# EAGLE design PPGGlove (EAGLE 9.6.2)
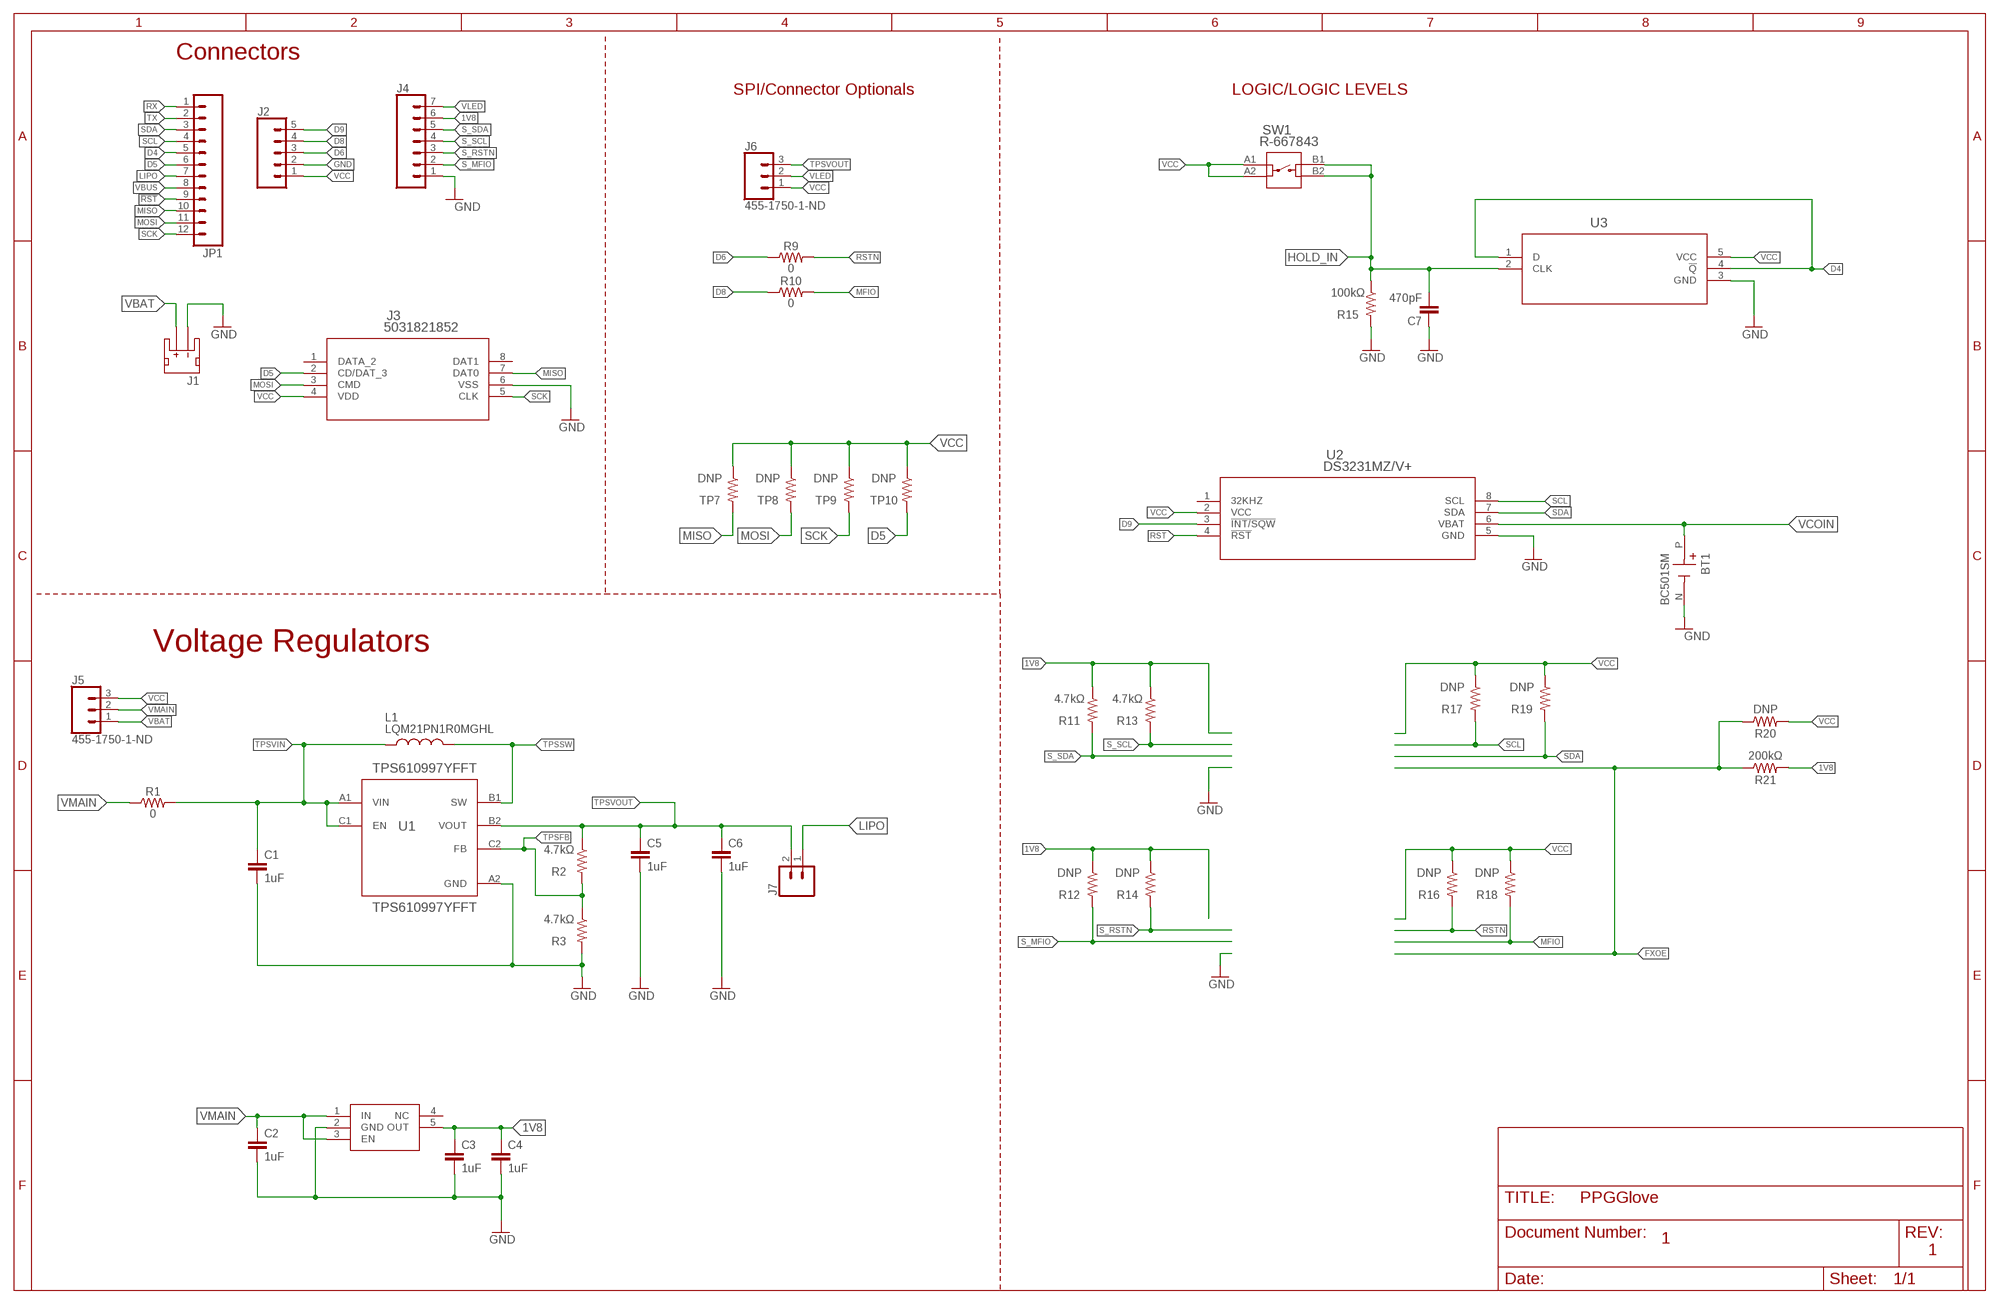
[diagram p0: schematic, sheet 1]

## Parts
BT1  BC501SM  [BAT_BC501SM]
C1  1uF  CAP-0805  [0805]
C2  1uF  CAP-0805  [0805]
C3  1uF  CAP-0805  [0805]
C4  1uF  CAP-0805  [0805]
C5  1uF  CAP-0805  [0805]
C6  1uF  CAP-0805  [0805]
C7  470pF  CAP-0805  [0805]
IC1  TPS7A0318DBVR  [SOT95P280X145-5N]
J1  JST_2MM_MALE  [JST-2-SMD]
J2  CONN_05  [1X05]
J3  5031821852  [503182-1852_MOL]
J4  CONN_07  [1X07]
J5  455-1750-1-ND  CONN_03  [1X03]
J6  455-1750-1-ND  CONN_03  [1X03]
J7  CONN_02  [1X02]
JP1  M12PTH  [1X12]
L1  LQM21PN1R0MGHL  [INDC2012X100N]
R1  0  RESISTOR0805  [0805]
R2  4.7kΩ  RESISTOR0805  [0805]
R3  4.7kΩ  RESISTOR0805  [0805]
R9  0  RESISTOR0805  [0805]
R10  0  RESISTOR0805  [0805]
R11  4.7kΩ  RESISTOR0805  [0805]
R12  DNP  RESISTOR0805  [0805]
R13  4.7kΩ  RESISTOR0805  [0805]
R14  DNP  RESISTOR0805  [0805]
R15  100kΩ  RESISTOR0805  [0805]
R16  DNP  RESISTOR0805  [0805]
R17  DNP  RESISTOR0805  [0805]
R18  DNP  RESISTOR0805  [0805]
R19  DNP  RESISTOR0805  [0805]
R20  DNP  RESISTOR0805  [0805]
R21  200kΩ  RESISTOR0805  [0805]
SW1  R-667843  [R-667843_MIT]
TP7  DNP  RESISTOR0805  [0805]
TP8  DNP  RESISTOR0805  [0805]
TP9  DNP  RESISTOR0805  [0805]
TP10  DNP  RESISTOR0805  [0805]
U1  TPS610997YFFT  [YFF0006AFAD]
U2  DS3231MZ/V+  [21-0041B_8_MXM]
U5  U3  SN74AUP1G80DBVR  [DBV5]

## Nets
1V8 [POWER]: C3.1 C4.1 IC1.5(OUT) J4.6 R11.1 R12.1 R13.1 R14.1 R21.2
!RST: JP1.9
D4: JP1.5 U5.1(D) U5.4(!Q)
D5: J3.2(CD/DAT_3) JP1.6 TP10.2
D6: J2.3 R9.1
D8: J2.4 R10.1
D9: J2.5 U2.3(!INT/SQW)
FXOE: R20.1 R21.1
GND [gnd]: BT1.N(-) C1.2 C2.2 C3.2 C4.2 C5.2 C6.2 C7.1 IC1.2(GND) J1.1(-) J2.2 J3.6(VSS) J4.1 R3.2 R15.2 U1.A2(GND) U2.5(GND) U5.3(GND)
HOLD_IN: C7.2 R15.1 SW1.B1 SW1.B2 U5.2(CLK)
LIPO [POWER]: J7.1 JP1.7
MFIO: R10.2 R18.2
MISO: J3.7(DAT0) JP1.10 TP7.2
MOSI: J3.3(CMD) JP1.11 TP8.2
RST: U2.4(!RST)
RSTN: R9.2 R16.2
RX: JP1.1
S_MFIO: J4.2 R12.2
S_RSTN: J4.3 R14.2
S_SCL: J4.4 R13.2
S_SDA: J4.5 R11.2
SCK: J3.5(CLK) JP1.12 TP9.2
SCL: JP1.4 R17.2 U2.8(SCL)
SDA: JP1.3 R19.2 U2.7(SDA)
TPSFB: R2.2 R3.1 U1.C2(FB)
TPSSW: L1.2 U1.B1(SW)
TPSVIN: C1.1 L1.1 R1.2 U1.A1(VIN) U1.C1(EN)
TPSVOUT [POWER]: C5.1 C6.1 J6.3 J7.2 R2.1 U1.B2(VOUT)
TX: JP1.2
VBAT [POWER]: J1.2(+) J5.1
VBUS [POWER]: JP1.8
VCC [POWER]: J2.1 J3.4(VDD) J5.3 J6.1 R16.1 R17.1 R18.1 R19.1 R20.2 SW1.A1 SW1.A2 TP7.1 TP8.1 TP9.1 TP10.1 U2.2(VCC) U5.5(VCC)
VCOIN [POWER]: BT1.P(+) U2.6(VBAT)
VLED [POWER]: J4.7 J6.2
VMAIN [POWER]: C2.1 IC1.1(IN) IC1.3(EN) J5.2 R1.1
Unconnected: IC1.4(NC) J1.NC1(PAD1) J1.NC2(PAD2) J3.1(DATA_2) J3.8(DAT1) U2.1(32KHZ)

## Notes on the sheet
- Connectors
- SPI/Connector Optionals | LOGIC/LOGIC LEVELS
- Voltage Regulators
- 1
- 1

## Library data of the parts
BT1 = BC501SM:BC501SM; DESCRIPTION: BATTERY HOLDER COIN 12MM SMD; DIGI-KEY_PART_NUMBER: BC501SM-ND; MF: MPD; MP: BC501SM; PACKAGE: None; PURCHASE-URL: https://pricing.snapeda.com/search/part/BC501SM/?ref=eda
C1-C7 = SparkFun-Capacitors:CAP
IC1 = SamacSys_Parts:TPS7A0318DBVR: LDO Voltage Regulators 200-mA, nanopower-IQ (200 nA), low-dropout (LDO) voltage regulator with enable 5-SOT-23 -40 to 125 Source: Datasheet <https://www.arrow.com/en/products/tps7a0318dbvr/texas-instruments>; ARROW_PART_NUMBER: TPS7A0318DBVR; ARROW_PRICE-STOCK: https://www.arrow.com/en/products/tps7a0318dbvr/texas-instruments; DESCRIPTION: LDO Voltage Regulators 200-mA, nanopower-IQ (200 nA), low-dropout (LDO) voltage regulator with enable 5-SOT-23 -40 to 125; HEIGHT: 1.45mm; MANUFACTURER_NAME: Texas Instruments; MANUFACTURER_PART_NUMBER: TPS7A0318DBVR; MOUSER_PART_NUMBER: 595-TPS7A0318DBVR; MOUSER_PRICE-STOCK: https://www.mouser.co.uk/ProductDetail/Texas-Instruments/TPS7A0318DBVR?qs=zW32dvEIR3svu15mOoFtOQ%3D%3D
J1 = SparkFun-Connectors:JST_2MM_MALE: JST 2MM MALE RA CONNECTOR Two pin, compact surface mount connector. Commonly used as a battery input connection point. We really like the solid locking feeling and high current rating on these small connectors. We use these all the time as battery connectors. Mates to single-cell LiPo batteries. Here is the connector we sell at SparkFun: JST Right Angle Connector - White <https://www.sparkfun.com/products/8612> (PRT-08612) Datasheet <http://www.sparkfun.com/datasheets/Prototyping/Connectors/JST-Horizontal.pdf> It was used on these SparkFun products: SparkFun MOSFET Power Controller <https://www.sparkfun.com/products/11214> (PRT-11214) SparkFun Battery Babysitter - LiPo Battery Manager <https://www.sparkfun.com/products/13777> (PRT-13777) And many, many others that required a lipo battery connection.; PROD_ID: CONN-11443; SF_ID: PRT-08612
J2 = SparkFun-Connectors:CONN_05: Multi connection point. Often used as Generic Header-pin footprint for 0.1 inch spaced/style header connections On any of the 0.1 inch spaced packages, you can populate with these: Break Away Headers - Straight <https://www.sparkfun.com/products/116> (PRT-00116) Break Away Male Headers - Right Angle <https://www.sparkfun.com/products/553> (PRT-00553) Female Headers <https://www.sparkfun.com/products/115> (PRT-00115) Break Away Headers - Machine Pin <https://www.sparkfun.com/products/117> (PRT-00117) Break Away Female Headers - Swiss Machine Pin <https://www.sparkfun.com/products/743> (PRT-00743) For SCREWTERMINALS and SPRING TERMINALS visit here: Screw Terimnals on SparkFun.com <https://www.sparkfun.com/search/results?term=Screw+Terminals> (5mm/3.5mm/2.54mm spacing) This device is also useful as a general connection point to wire up your design to another part of your project. Our various solder wires solder well into these plated through hole pads. Hook-Up Wire - Assortment (Stranded, 22 AWG) <https://www.sparkfun.com/products/11375> (PRT-11375) Hook-Up Wire - Assortment (Solid Core, 22 AWG) <https://www.sparkfun.com/products/11367> (PRT-11367) View the entire wire category on our website here <https://www.sparkfun.com/categories/141> Special notes: Molex polarized connector foot print use with SKU : PRT-08231 with associated crimp pins and housings. 1MM SMD Version SKU: PRT-10208
J3 = PPG-part2:5031821852; COPYRIGHT: Copyright (C) 2022 Ultra Librarian. All rights reserved.; MANUFACTURER_PART_NUMBER: 5031821852; MFR_NAME: Molex Connector Corporation
J4 = SparkFun-Connectors:CONN_07: Multi connection point. Often used as Generic Header-pin footprint for 0.1 inch spaced/style header connections On any of the 0.1 inch spaced packages, you can populate with these: Break Away Headers - Straight <https://www.sparkfun.com/products/116> (PRT-00116) Break Away Male Headers - Right Angle <https://www.sparkfun.com/products/553> (PRT-00553) Female Headers <https://www.sparkfun.com/products/115> (PRT-00115) Break Away Headers - Machine Pin <https://www.sparkfun.com/products/117> (PRT-00117) Break Away Female Headers - Swiss Machine Pin <https://www.sparkfun.com/products/743> (PRT-00743) For SCREWTERMINALS and SPRING TERMINALS visit here: Screw Terimnals on SparkFun.com <https://www.sparkfun.com/search/results?term=Screw+Terminals> (5mm/3.5mm/2.54mm spacing) This device is also useful as a general connection point to wire up your design to another part of your project. Our various solder wires solder well into these plated through hole pads. Hook-Up Wire - Assortment (Stranded, 22 AWG) <https://www.sparkfun.com/products/11375> (PRT-11375) Hook-Up Wire - Assortment (Solid Core, 22 AWG) <https://www.sparkfun.com/products/11367> (PRT-11367) View the entire wire category on our website here <https://www.sparkfun.com/categories/141> Special notes: Molex polarized connector foot print use with SKU : PRT-08231 with associated crimp pins and housings. 1MM SMD Version SKU: PRT-10208 NOTES ON THE VARIANTS LOCK and LOCK_LONGPADS... This footprint was designed to help hold the alignment of a through-hole component (i.e. 6-pin header) while soldering it into place. You may notice that each hole has been shifted either up or down by 0.005 of an inch from it's more standard position (which is a perfectly straight line). This slight alteration caused the pins (the squares in the middle) to touch the edges of the holes. Because they are alternating, it causes a "brace" to hold the component in place. 0.005 has proven to be the perfect amount of "off-center" position when using our standard breakaway headers. Although looks a little odd when you look at the bare footprint, once you have a header in there, the alteration is very hard to notice. Also,if you push a header all the way into place, it is covered up entirely on the bottom side.
J5 J6 = SparkFun-Connectors:CONN_03: Multi connection point. Often used as Generic Header-pin footprint for 0.1 inch spaced/style header connections On any of the 0.1 inch spaced packages, you can populate with these: Break Away Headers - Straight <https://www.sparkfun.com/products/116> (PRT-00116) Break Away Male Headers - Right Angle <https://www.sparkfun.com/products/553> (PRT-00553) Female Headers <https://www.sparkfun.com/products/115> (PRT-00115) Break Away Headers - Machine Pin <https://www.sparkfun.com/products/117> (PRT-00117) Break Away Female Headers - Swiss Machine Pin <https://www.sparkfun.com/products/743> (PRT-00743) Stackable Header - 3 Pin (Female, 0.1") <https://www.sparkfun.com/products/13875> (PRT-13875) For SCREWTERMINALS and SPRING TERMINALS visit here: Screw Terimnals on SparkFun.com <https://www.sparkfun.com/search/results?term=Screw+Terminals> (5mm/3.5mm/2.54mm spacing) This device is also useful as a general connection point to wire up your design to another part of your project. Our various solder wires solder well into these plated through hole pads. Hook-Up Wire - Assortment (Stranded, 22 AWG) <https://www.sparkfun.com/products/11375> (PRT-11375) Hook-Up Wire - Assortment (Solid Core, 22 AWG) <https://www.sparkfun.com/products/11367> (PRT-11367) View the entire wire category on our website here <https://www.sparkfun.com/categories/141> Special notes: Molex polarized connector foot print use with SKU : PRT-08232 with associated crimp pins and housings.; PROD_ID: XXX-00000
J7 = SparkFun-Connectors:CONN_02: Multi connection point. Often used as Generic Header-pin footprint for 0.1 inch spaced/style header connections On any of the 0.1 inch spaced packages, you can populate with these: Break Away Headers - Straight <https://www.sparkfun.com/products/116> (PRT-00116) Break Away Male Headers - Right Angle <https://www.sparkfun.com/products/553> (PRT-00553) Female Headers <https://www.sparkfun.com/products/115> (PRT-00115) Break Away Headers - Machine Pin <https://www.sparkfun.com/products/117> (PRT-00117) Break Away Female Headers - Swiss Machine Pin <https://www.sparkfun.com/products/743> (PRT-00743) For SCREWTERMINALS and SPRING TERMINALS visit here: Screw Terimnals on SparkFun.com <https://www.sparkfun.com/search/results?term=Screw+Terminals> (5mm/3.5mm/2.54mm spacing) This device is also useful as a general connection point to wire up your design to another part of your project. Our various solder wires solder well into these plated through hole pads. Hook-Up Wire - Assortment (Stranded, 22 AWG) <https://www.sparkfun.com/products/11375> (PRT-11375) Hook-Up Wire - Assortment (Solid Core, 22 AWG) <https://www.sparkfun.com/products/11367> (PRT-11367) View the entire wire category on our website here <https://www.sparkfun.com/categories/141> Special notes: Molex polarized connector foot print use with: PRT-08233 with associated crimp pins and housings. 2.54_SCREWTERM for use with PRT-10571. 3.5mm Screw Terminal footprints for PRT-08084 5mm Screw Terminal footprints for use with PRT-08432
JP1 = SparkFun-Connectors:M12: Header 12 Standard 12-pin 0.1" header. Use with straight break away headers (SKU : PRT-00116), right angle break away headers (PRT-00553), swiss pins (PRT-00743), machine pins (PRT-00117), and female headers (PRT-00115).; PROD_ID: CONN-09693
L1 = LQM21PN1R0MGHL:LQM21PN1R0MGHL: Ind Power Chip Shielded 1uH 20% 1MHz Ferrite 1.1A 0805 Embossed T/R; DESCRIPTION: Inductor with Inductance: 1uH Tol. +/-20%, Package: 0805 (2012); DIGI-KEY_PART_NUMBER: 490-9572-2-ND; MF: Murata; MP: LQM21PN1R0MGHL; PACKAGE: 2012 Murata; PURCHASE-URL: https://pricing.snapeda.com/search/part/LQM21PN1R0MGHL/?ref=eda
R1-R3 R9-R21 TP7-TP10 = SparkFun-Resistors:RESISTOR: Generic Resistor Package
SW1 = additionallppg:R-667843; COPYRIGHT: Copyright (C) 2022 Ultra Librarian. All rights reserved.; DIGI-KEY_PART_NUMBER_1: 2508-R-667843TR-ND; DIGI-KEY_PART_NUMBER_2: 2508-R-667843CT-ND; DIGI-KEY_PART_NUMBER_3: 2508-R-667843DKR-ND; MANUFACTURER_PART_NUMBER: R-667843; MFR_NAME: Mitsumi
U1 = additionallppg:TPS610997YFFT; COPYRIGHT: Copyright (C) 2022 Ultra Librarian. All rights reserved.; DIGI-KEY_PART_NUMBER_1: 2156-TPS610997YFFT-ND; DIGI-KEY_PART_NUMBER_2: 296-TPS610997YFFTCT-ND; DIGI-KEY_PART_NUMBER_3: 296-TPS610997YFFTDKR-ND; DIGI-KEY_PART_NUMBER_4: 296-TPS610997YFFTTR-ND; DIGI-KEY_PART_NUMBER_5: TPS610997YFFT-ND; MANUFACTURER_PART_NUMBER: TPS610997YFFT; MFR_NAME: Texas Instruments; REFDES: RefDes; TYPE: TYPE
U2 = additionallppg:DS3231MZ/V+; COPYRIGHT: Copyright (C) 2022 Ultra Librarian. All rights reserved.; DIGI-KEY_PART_NUMBER_1: DS3231MZ/V+-ND; MANUFACTURER_PART_NUMBER: DS3231MZ/V+; MFR_NAME: Maxim Integrated Products
U5 = PPG-part2:SN74AUP1G80DBVR; COPYRIGHT: Copyright (C) 2022 Ultra Librarian. All rights reserved.; DIGI-KEY_PART_NUMBER_1: 296-17841-1-ND; DIGI-KEY_PART_NUMBER_2: 296-17841-2-ND; DIGI-KEY_PART_NUMBER_3: 296-17841-6-ND; DIGI-KEY_PART_NUMBER_4: 2156-SN74AUP1G80DBVR-ND; MANUFACTURER_PART_NUMBER: SN74AUP1G80DBVR; MFR_NAME: Texas Instruments

## Net classes
1 usb: width 0.19 mm, drill 0.19 mm, clearance 0.127 mm

## Board
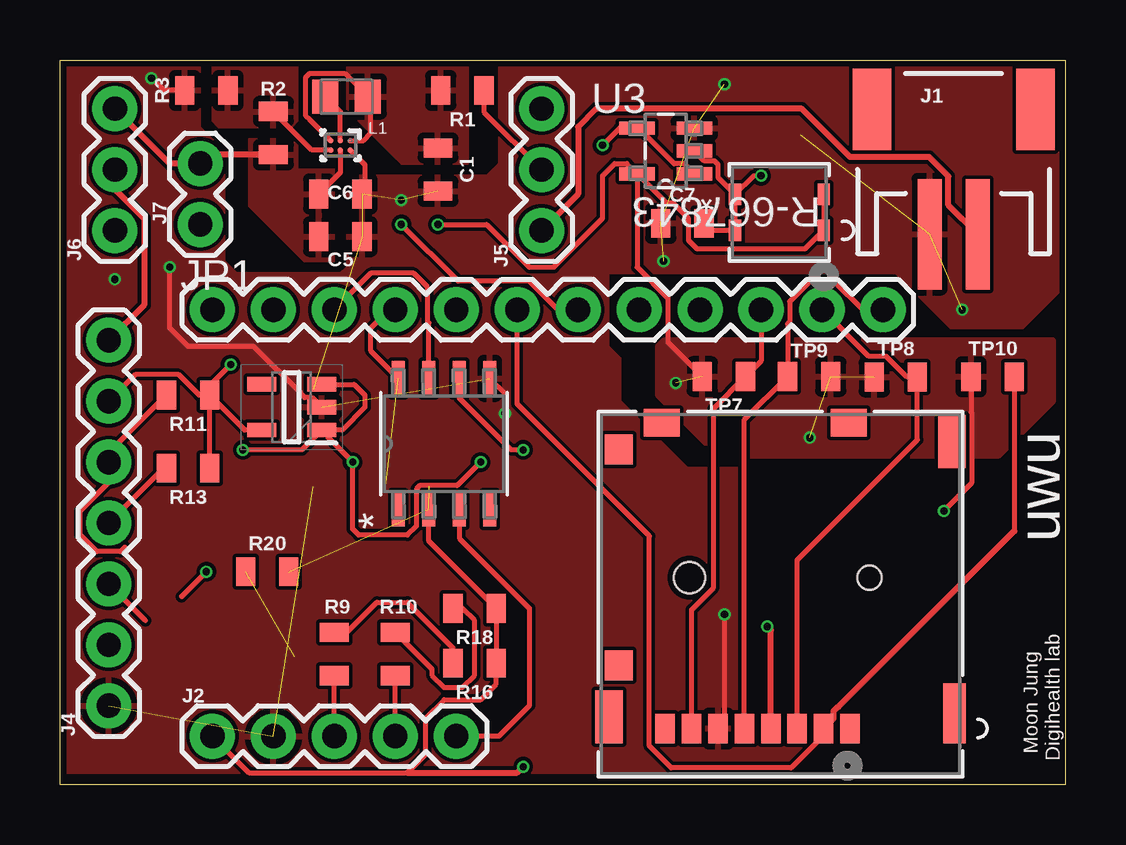
[diagram p1: board, top side]
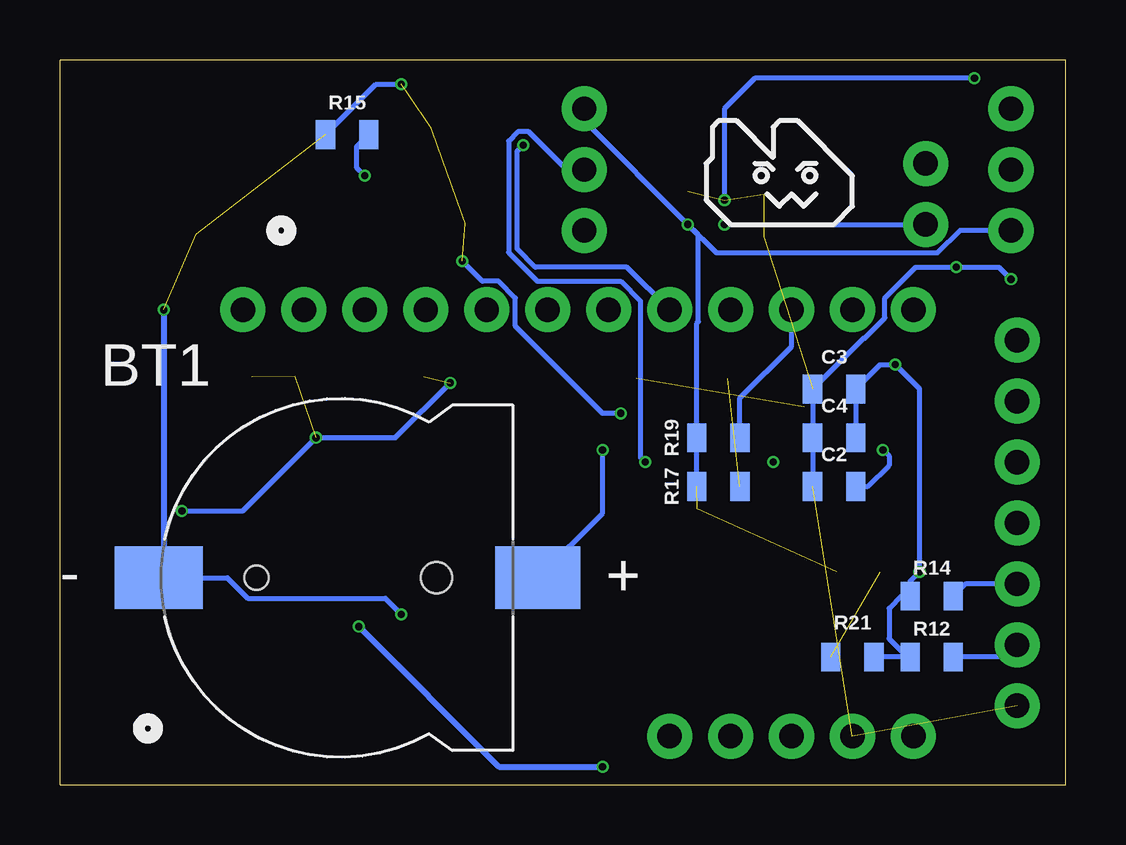
[diagram p2: board, bottom side, seen from below]

Size 41.91 x 30.23 mm. Coordinates in mm from the lower left corner, seen from the top.
Outline: 0,0 0,30.23 41.91,30.23 41.91,0 0,0
Copper layers (1*16): Top 0.035mm / dielectric 0.2mm / Bottom 0.035mm
Design rules "SeeedStudio_4layers *": minimum track width 8mil, minimum drill 0.19mm, track to track 6mil, track to pad 6mil, pad to pad 6mil, via to via 8mil, smd to smd 0mil, copper to edge 10mil, drill to drill 8mil, minimum pad ring 6mil, minimum via ring 4mil, stop-mask expansion 4mil, vias tented up to drill 20mil, thermal gap 10mil

### Footprints (pad centres in the part's own frame; a part is rotated, then mirrored left to right if it is on the bottom)
BAT_BC501SM = smd 3.66 x 2.6: N -7.57,0 | smd 3.54 x 2.6: P 8.23,0 | hole 1: -3.5,0 | hole 1.3: 4,0
0805 = smd 0.8 x 1.2: 1 -0.9,0; 2 0.9,0
SOT95P280X145-5N = smd 1.2 x 0.6: 1 -1.25,0.95; 2 -1.25,0; 3 -1.25,-0.95; 4 1.25,-0.95; 5 1.25,0.95
JST-2-SMD = smd 1 x 4.6: 1 -1,-3.7; 2 1,-3.7 | smd 1.6 x 3.4: NC1 -3.4,1.5; NC2 3.4,1.5
1X05 = drill 1.016 pad 1.88: 1 0,0; 2 2.54,0; 3 5.08,0; 4 7.62,0; 5 10.16,0
503182-1852_MOL = smd 0.813 x 1.245: 1 -2.9,-5.61; 2 -1.8,-5.61; 3 -0.7,-5.61; 4 0.4,-5.61; 5 1.5,-5.61; 6 2.6,-5.61; 7 3.7,-5.61; 8 4.8,-5.61 | smd 1.499 x 1.143: 9 -2.84,-18.365; 10 4.94,-18.365 | smd 0.94 x 2.489: 11 -7.245,-6.24 | smd 1.143 x 2.21: 12 7.145,-6.09; 13 -7.145,-17.57 | smd 1.168 x 1.245: 14 6.74,-8.24; 15 6.74,-17.24
1X07 = drill 1.016 pad 1.88: 1 0,0; 2 2.54,0; 3 5.08,0; 4 7.62,0; 5 10.16,0; 6 12.7,0; 7 15.24,0
1X03 = drill 1.016 pad 1.88: 1 0,0; 2 2.54,0; 3 5.08,0
1X02 = drill 1.016 pad 1.88: 1 0,0; 2 2.54,0
1X12 = drill 1.016 pad 1.88: 1 0,0; 2 2.54,0; 3 5.08,0; 4 7.62,0; 5 10.16,0; 6 12.7,0; 7 15.24,0; 8 17.78,0; 9 20.32,0; 10 22.86,0; 11 25.4,0; 12 27.94,0
INDC2012X100N = smd 1.1 x 1.42: 1 -0.885,0; 2 0.885,0
R-667843_MIT = smd 0.508 x 0.889: A1 -1.85,0.75; A2 -1.85,-0.75; B1 1.85,0.75; B2 1.85,-0.75
YFF0006AFAD = smd 0.23 x 0.23: A1 -0.2,0.4; A2 0.2,0.4; B1 -0.2,0; B2 0.2,0; C1 -0.2,-0.4; C2 0.2,-0.4
21-0041B_8_MXM = smd 1.46 x 0.533: 1 -2.724,1.905; 2 -2.724,0.635; 3 -2.724,-0.635; 4 -2.724,-1.905; 5 2.724,-1.905; 6 2.724,-0.635; 7 2.724,0.635; 8 2.724,1.905
DBV5 = smd 1.473 x 0.559: 1 -1.194,0.95; 2 -1.194,0; 3 -1.194,-0.95; 4 1.194,-0.95; 5 1.194,0.95

### Placement (x,y rotation side)
BT1  30.23,8.64 0 bottom
C1  15.75,25.65 270 top
C2  9.65,12.45 180 bottom
C3  9.65,16.51 180 bottom
C4  9.65,14.48 180 bottom
C5  11.68,22.86 0 top
C6  11.68,24.64 0 top
C7  25.93,23.42 0 top
IC1  9.65,15.75 180 top
J1  37.24,26.66 0 top
J2  6.35,2.03 0 top
J3  30.02,-3.26 180 top
J4  2.03,3.3 90 top
J5  20.07,23.11 90 top
J6  2.29,23.11 90 top
J7  5.84,23.37 90 top
JP1  6.35,19.81 0 top
L1  11.94,28.7 180 top
R1  16.76,28.96 180 top
R2  8.89,27.18 90 top
R3  6.1,28.96 180 top
R9  11.43,5.46 90 top
R10  13.97,5.46 90 top
R11  5.33,16.26 180 top
R12  5.59,5.33 0 bottom
R13  5.33,13.21 180 top
R14  5.59,7.87 0 bottom
R15  29.95,27.11 180 bottom
R16  17.27,5.08 180 top
R17  14.48,12.45 0 bottom
R18  17.27,7.37 180 top
R19  14.48,14.48 0 bottom
R20  8.64,8.89 0 top
R21  8.89,5.33 0 bottom
SW1  29.97,23.88 180 top
TP7  27.66,17.03 0 top
TP8  34.82,17.01 0 top
TP9  31.21,17.03 180 top
TP10  38.86,17.02 0 top
U1  11.68,26.67 270 top
U2  16,14.22 90 top
U5  25.24,26.43 180 top

### Tracks (layer width: path | path; a pad name or v marks a point on that pad's centre or on a via)
1V8  (via drill 0.3)
  Top 0.203: IC1.5 7.69,14.8 R11.1 | R11.1 5.79,16.26 4.94,17.11 3.14,17.11 J4.6 | R13.1 R11.1 | R11.1 6.23,16.65 v7.11,17.53 | 5.06,7.85 v6.1,8.89
  Bottom 0.203: C4.1 C3.1 7.74,17.53 v7.11,17.53 6.1,16.51 v6.1,8.89 6.49,8.5 R14.1 6.86,7.87 7.37,7.37 7.37,6.1 6.6,5.33 | R12.1 6.6,5.33 | 6.6,5.33 R21.2
D4  (via drill 0.3)
  Top 0.203: U5.1 26.02,25.9 25.59,25.9 24.11,27.38 U5.4 23.32,27.38 v22.61,26.67
  Bottom 0.203: JP1.5 18.29,21.59 22.1,21.59 22.86,22.35 22.86,26.42 v22.61,26.67
D5
  Top 0.203: TP10.2 39.76,10.58 | JP1.6 19.05,15.88 24.56,10.38 24.56,1.62 25.47,0.71 30.47,0.71 31.82,2.06 J3.2
  Top 0.254: J3.2 32.23,2.77 32.23,3.09 32.4,3.25 32.43,3.25 39.76,10.58
D6
  Top 0.203: J2.3 R9.1
D8
  Top 0.203: J2.4 R10.1
D9
  Top 0.203: U2.3 16.64,10.29 19.56,7.37 19.56,3.3 18.29,2.03 J2.5
FXOE  (1 unrouted)
GND  (via drill 0.3)  (12 unrouted)
  Top 0.203: U1.A2 12.7,25.85 12.7,24.75 C6.2 | IC1.2 10.51,16.14 10.2,16.14 10.05,16.29 10.05,16.31 8.07,18.29 5.33,18.29 4.57,19.05 v4.57,21.59 | U2.5 18.54,16.31 v18.54,15.49 | v27.69,7.11 27.69,2.62 J3.6 | R3.2 4.32,28.96 v3.81,29.46
  Bottom 0.203: BT1.N 34.94,8.64 34.08,7.78 28.35,7.78 v27.69,7.11 | R15.2 28.75,29.21 v27.69,29.21 | v18.54,15.49 19.3,15.49 22.94,19.13 22.94,20.31 23.64,21.01 24.31,21.01 v25.15,21.84 | C2.2 C4.2 C3.2 8.44,18.62 8.4,18.62 7.54,19.47 7.54,20.31 6.26,21.59 v4.57,21.59 2.79,21.59 v2.29,21.08 | v3.81,29.46 12.95,29.46 14.22,28.19 v14.22,24.38
  Bottom 0.254: v37.59,19.81 37.59,8.84 BT1.N
  pour Top: 5.84,27.43 5.84,29.97 0.25,29.97 0.25,0.51 41.15,0.51 41.15,13.21 26.16,13.21 23.37,16 23.37,17.78 22.86,18.29 22.86,21.34 34.8,21.34 37.08,19.05 40.13,19.05 41.66,20.57 41.66,29.97 18.29,29.97 18.29,25.91 17.78,25.4 11.94,25.4 11.94,21.59 11.68,21.34 7.37,21.34 6.86,21.84 6.86,26.42
HOLD_IN  (via drill 0.3)
  Top 0.203: SW1.B2 SW1.B1 27.12,23.13 C7.2 | SW1.B2 27.42,25.32 27.42,25.87 27.28,26.02 26.85,26.02 U5.2 | SW1.B2 28.9,25.4 v29.21,25.4
  Bottom 0.203: R15.1 29.56,26.61 29.56,25.75 v29.21,25.4
LIPO  (via drill 0.3)
  Top 0.203: v14.22,23.37 16.59,21.01 19.54,21.01 20.74,19.81 JP1.7
  Bottom 0.203: v14.22,23.37 J7.1
MFIO
  Top 0.203: R10.2 15.49,4.84 15.49,4.57 16,4.06 16.76,4.06 17.27,4.57 17.27,6.86 16.76,7.37 R18.2
MISO
  Top 0.203: JP1.10 29.21,17.68 28.75,17.22 TP7.2 27.23,15.7 27.23,8.22 26.32,7.31 J3.7
MOSI
  Top 0.203: J3.3 30.72,9.38 35.73,14.39 TP8.2 35.28,17.01 34.43,17.86 33.7,17.86 JP1.11
RSTN
  Top 0.203: R9.2 11.95,6.36 13.21,7.62 14.48,7.62 16.37,5.73 R16.2
S_MFIO
  Top 0.203: 2.55,6.36 J4.2
  Bottom 0.203: J4.2 2.54,5.33 R12.2
S_RSTN
  Top 0.203: 3.56,6.86 J4.3
  Bottom 0.203: J4.3 4.18,8.38 R14.2
S_SCL
  Top 0.203: 2.54,10.41 J4.4 4.32,13.21 R13.2
S_SDA
  Top 0.203: 2.71,9.91 2.53,9.73 1.54,9.73 0.84,10.43 0.84,11.42 2.03,12.61 J4.5 2.03,13.85 R11.2
SCK
  Top 0.203: J3.5 28.52,15.23 TP9.2 30.32,19.23 30.4,19.32 30.4,20.15 31.26,21.01 32.24,21.01 33.44,19.81 JP1.12
SCL  (1 unrouted)
  Top 0.203: U2.8 12.95,18.09 12.95,19.05 13.72,19.81 JP1.4
SDA
  Top 0.203: U2.7 15.37,19.27 15.32,19.32 15.32,20.75 14.73,21.34 12.95,21.34 JP1.3
  Bottom 0.203: R19.2 13.58,16.14 11.43,18.29 JP1.3
TPSFB
  Top 0.203: U1.C2 10.5,26.47 R2.2
  pour Top: 6.35,29.97 6.35,27.69 6.6,27.43 9.65,27.43 9.91,27.69 9.91,29.97
TPSSW
  Top 0.203: U1.B1 11.68,28.07 L1.2
TPSVIN
  Top 0.203: U1.A1 12.65,26.87 12.95,27.18 12.95,28.57 L1.1 11.86,29.67 10.4,29.67 10.25,29.52 10.25,27.89 10.4,27.74 10.42,27.74 U1.C1
  pour Top: 11.94,29.97 11.94,28.19 12.7,27.43 14.22,25.91 17.02,25.91 17.02,29.97
TPSVOUT
  Top 0.203: U1.B2 11.68,25.54 C6.1
  Top 0.254: R2.1 6.21,26.28 J7.2 4.57,25.91 J6.3
  pour Top: 7.87,26.92 7.87,24.13 10.16,21.84 11.43,21.84 11.43,25.65 9.91,25.65 9.91,26.92
VBAT
  Top 0.254: J1.2 37.02,24.18 37.02,25.38 36.21,26.18 32.92,26.18 30.91,28.19 22.35,28.19 21.59,27.43 21.59,24.64 J5.1
VCC  (via drill 0.3)  (5 unrouted)
  Top 0.203: U5.5 24.05,21.58 25.32,20.31 25.32,18.46 TP7.1 | U5.5 25.26,24.27 25.54,24.27 26.18,23.63 26.18,22.71 26.54,22.35 31.05,22.35 SW1.A1 SW1.A2 | v15.75,23.37 17.78,23.37 19.56,21.59 20.57,21.59 22.61,23.62 22.61,25.4 23.11,25.91 23.62,25.91 U5.5 | J2.1 7.87,0.51 14.48,0.51 15.24,1.27 15.24,2.79 16,3.56 17.53,3.56 18.17,4.2 R16.1 R18.1 15.44,10.1 15.37,10.17 U2.2 | TP10.1 37.96,15.55 37.99,15.52 37.99,12.59 v36.83,11.43
  Top 0.254: J3.4 29.62,6.45 v29.46,6.6 | 14.48,0.51 19.05,0.51 v19.3,0.76
  Bottom 0.203: R17.1 R19.1 15.38,19.26 15.32,19.32 15.32,22.94 v15.75,23.37 | J6.1 4.41,23.11 5.35,22.17 14.55,22.17 v15.75,23.37 | J5.3 20.07,27.69 v15.75,23.37 | v36.83,11.43 34.29,11.43 v31.24,14.48 27.94,14.48 v25.65,16.76
  Bottom 0.254: v29.46,6.6 23.62,0.76 v19.3,0.76
  pour Top: 24.89,18.29 24.89,16.26 27.43,13.72 39.12,13.72 41.4,16 41.4,18.54 25.15,18.54
VCOIN  (via drill 0.3)
  Top 0.203: v19.3,13.97 18.8,13.97 16.64,16.13 U2.6
  Bottom 0.203: BT1.P 19.3,11.33 v19.3,13.97
VLED
  Top 0.254: J6.2 2.29,24.84 3.51,23.62 3.51,20.02 J4.7
VMAIN  (via drill 0.3)
  Top 0.203: R1.1 17.66,28.06 J5.2 | IC1.3 12.26,16.7 12.7,16.26 12.7,15.75 11.75,14.8 11.18,14.8 | 11.18,14.8 IC1.1 10.07,13.97 v7.62,13.97 | 11.18,14.8 11.18,14.48 v12.19,13.46 12.19,10.67 12.45,10.41 14.48,10.41 14.85,10.78 14.85,12.33 14.99,12.48 16.55,12.48 v17.53,13.46
  Bottom 0.203: C2.1 8.24,12.45 7.37,13.32 7.37,13.72 v7.62,13.97 | v17.53,13.46 17.73,13.67 17.73,20.18 18.56,21.01 22.02,21.01 23.22,22.2 23.22,26.85 22.84,27.23 22.38,27.23 20.8,25.65 J5.2

### Text on the board
tNames: uwu | Moon Jung | Digihealth lab
test-probe: 5V | VIN(5V) | VCC | GND | RESET | 14 | 13 | 12 | 11 | 10 | 9 | 8 | 7 | 6 | USB_5V | USB_D- | SWCLK | SWDIO | JGND | JRST | VTG | BATT+ | BATT- | USB_D+ | USB_GND | AREF | A0 | A1 | A2 | A3 | A4 | A5 | A6 | 0 | 1 | 2 | 3 | 4 | 5